# EasyEDA schematic SCH_L298N_shame_2022-05-20.json
TITLE: L298N; REV: 1.0; Date: 2022-05-20; Sheet: 1/1; Drawn By: Дмитрий Григорьев; Company: Your Company
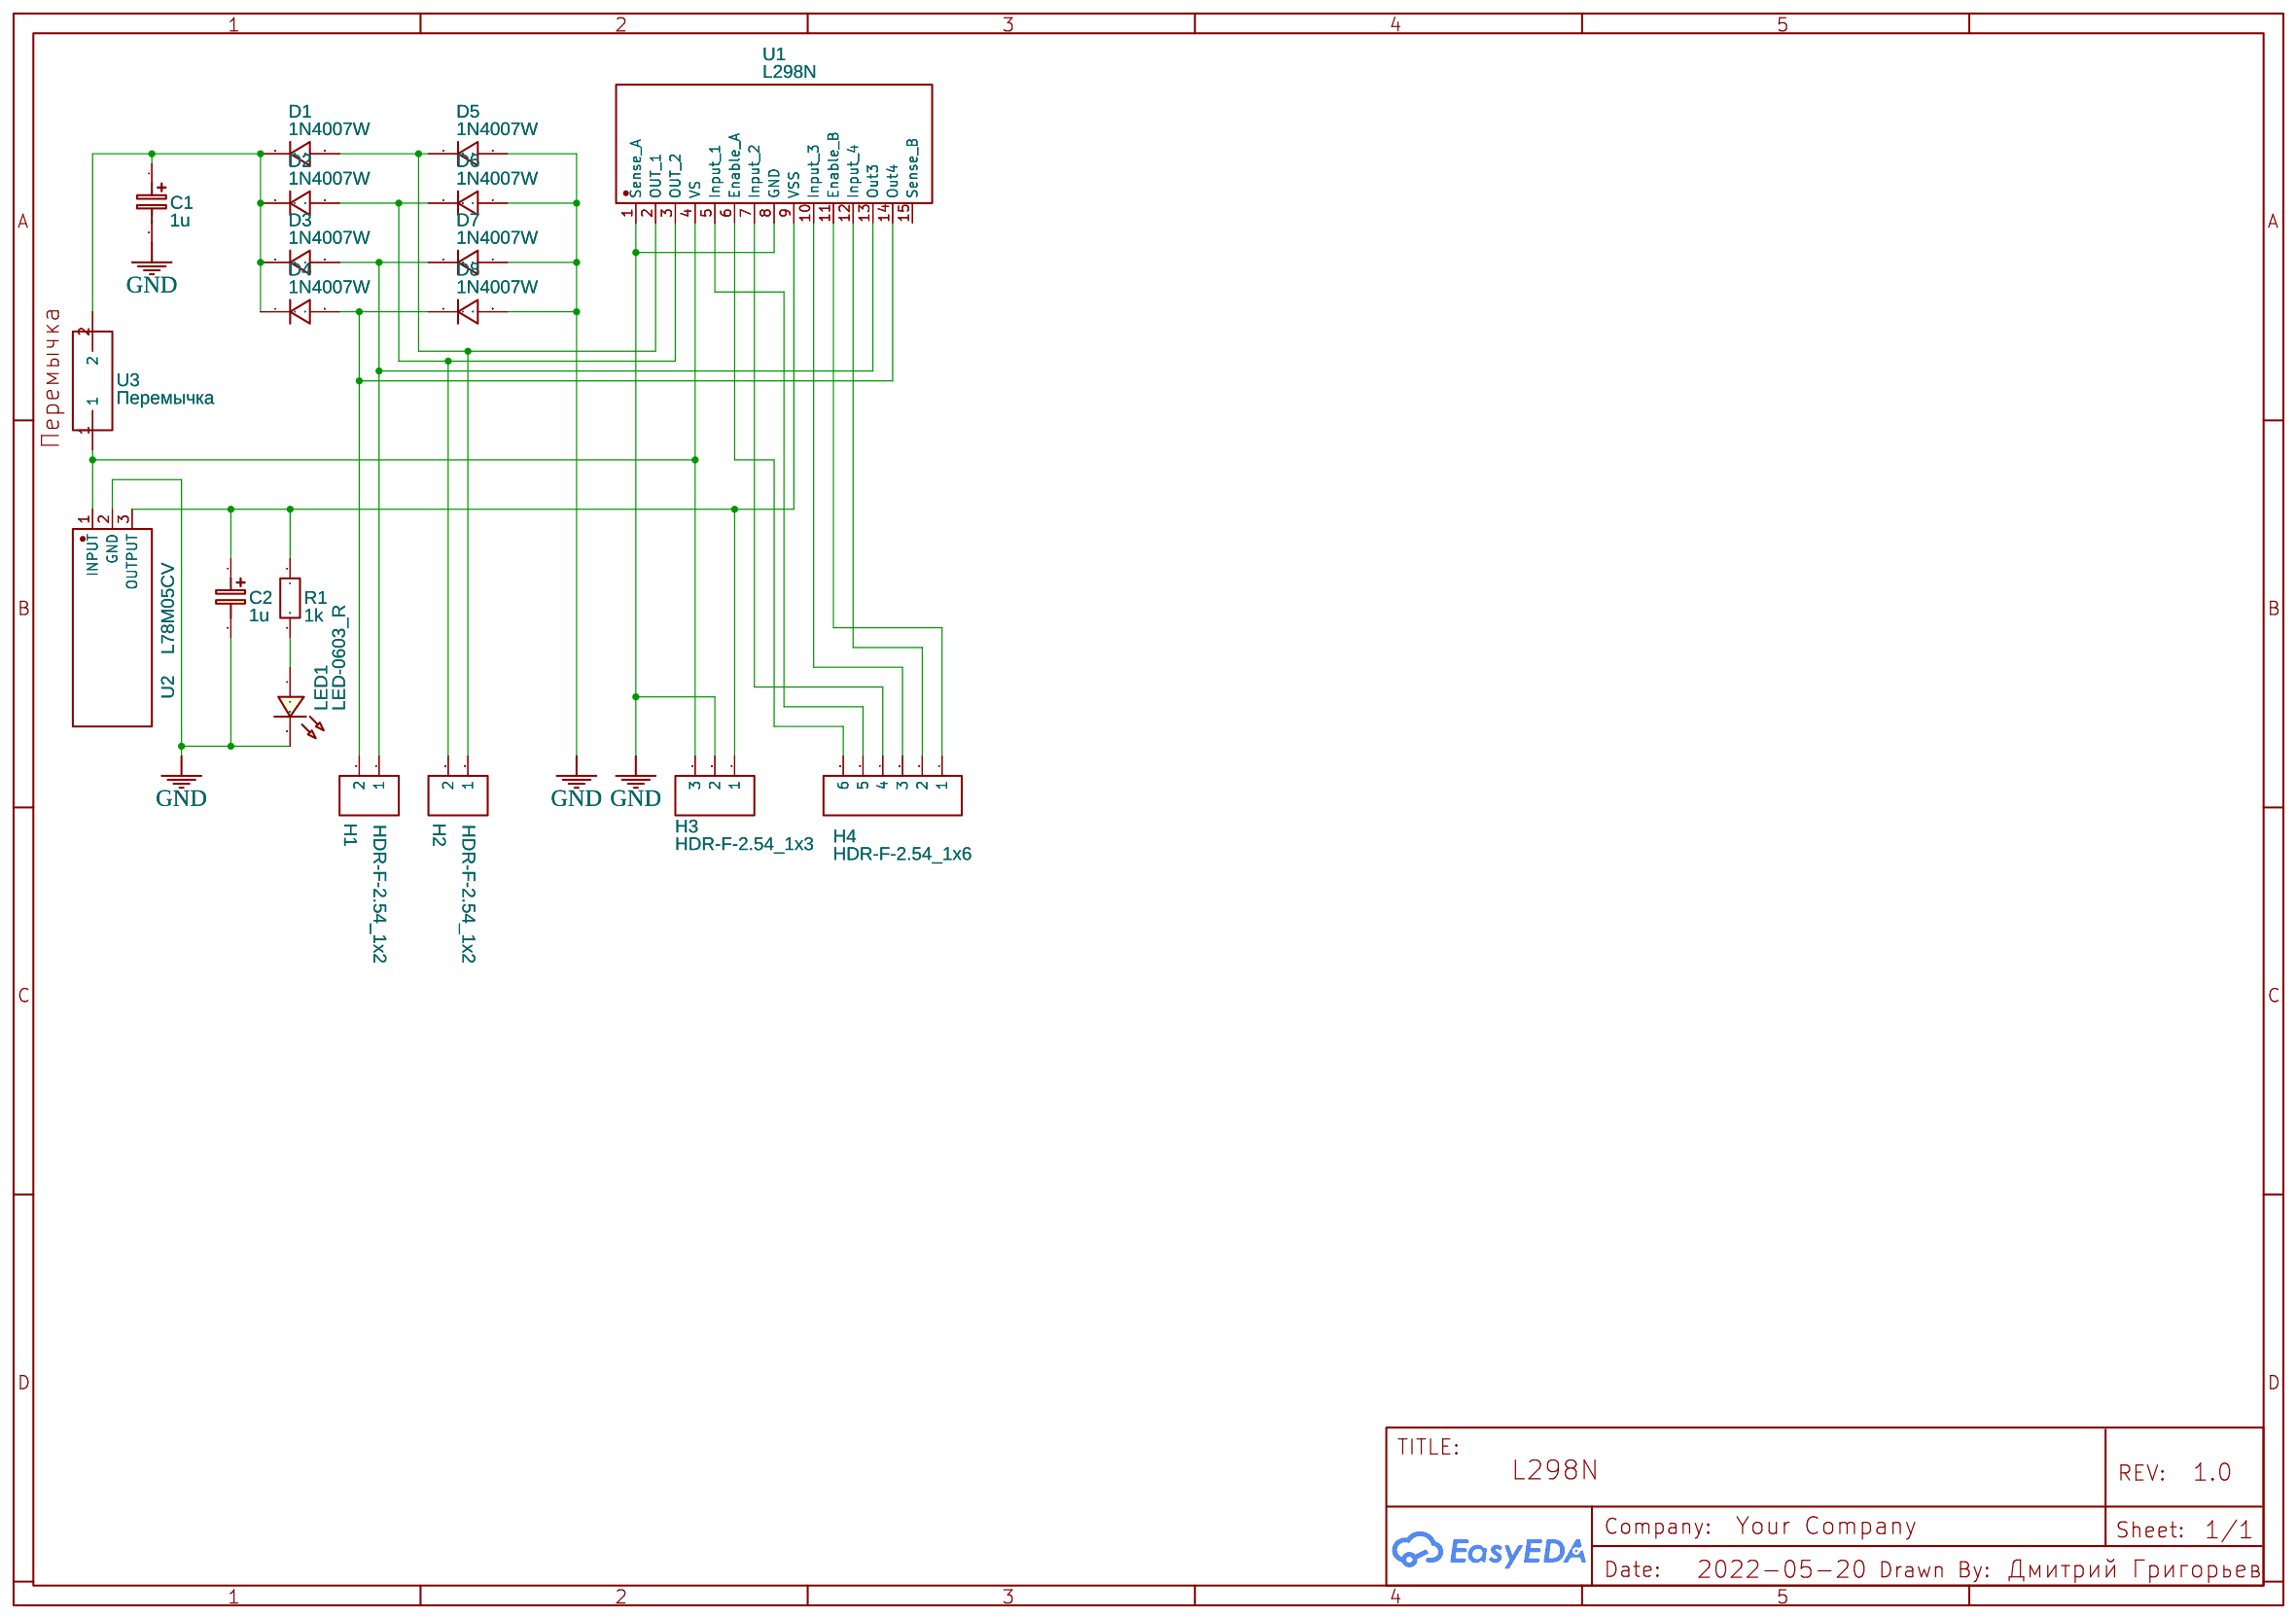
[diagram p0: schematic sheet]

## Parts
C1  1u  [CASE-A_3216]
C2  1u  [CASE-A_3216]
D1  1N4007W  [SOD-123_L2.8-W1.8-LS3.7-RD]
D2  1N4007W  [SOD-123_L2.8-W1.8-LS3.7-RD]
D3  1N4007W  [SOD-123_L2.8-W1.8-LS3.7-RD]
D4  1N4007W  [SOD-123_L2.8-W1.8-LS3.7-RD]
D5  1N4007W  [SOD-123_L2.8-W1.8-LS3.7-RD]
D6  1N4007W  [SOD-123_L2.8-W1.8-LS3.7-RD]
D7  1N4007W  [SOD-123_L2.8-W1.8-LS3.7-RD]
D8  1N4007W  [SOD-123_L2.8-W1.8-LS3.7-RD]
H1  HDR-F-2.54_1x2  [HDR-F-2.54_1X2]
H2  HDR-F-2.54_1x2  [HDR-F-2.54_1X2]
H3  HDR-F-2.54_1x3  [HDR-F-2.54_1X3]
H4  HDR-F-2.54_1x6  [HDR-F-2.54_1X6]
LED1  LED-0603_R  [LED0603_RED]
R1  1k  [R0603]
U1  L298N  [MULTIWATT-15_L19.6-W5.0-P1.27-L]
U2  L78M05CV  [TO-220-3_L10.0-W4.5-P2.54-L]
U3  Перемычка  [ПЕРЕМЫЧКА]

## Library data of the parts
C1 C2 = C_Tan_SMD_A_EU: Contributor: LCEDA_Lib
D1-D8 = 1N4007W: Supplier: LCSC; Supplier Part: C328592; Manufacturer: BLUE ROCKET; Contributor: LCEDA_Lib
H1 H2 = HDR-F-2.54_1x2: Supplier Part: C49661; Supplier: LCSC; Contributor: LCEDA_Lib
H3 = HDR-F-2.54_1x3: Supplier Part: C146690; Supplier: LCSC; Contributor: LCEDA_Lib
H4 = HDR-F-2.54_1x6: Supplier Part: C40877; Supplier: LCSC; Contributor: LCEDA_Lib
LED1 = LED-0603_R: Manufacturer: EVERLIGHT(台湾亿光); Manufacturer Part: 19-217/R6C-AL1M2VY/3T; Supplier Part: C72044; Supplier: LCSC; Contributor: LCEDA_01
R1 = R_0603_EU: Contributor: LCEDA_Lib
U1 = L298N: Supplier: LCSC; Supplier Part: C434589; Manufacturer: HGSEMI; Contributor: LCSC; JLCPCB Part Class: Extended Part
U2 = L78M05CV: Supplier: LCSC; Supplier Part: C283462; Manufacturer: STMicroelectronics; Contributor: LCSC; JLCPCB Part Class: Extended Part
U3 = Перемычка: Manufacturer Part: New SchematicLib; Contributor: protoplaz

## Nets
GND: C1.2 C2.2 D5.2 D6.2 D7.2 D8.2 H3.2 LED1.2 U1.1(Sense A) U1.8(GND) U2.2(GND)
Net-(C1-1): C1.1 D1.1 D2.1 D3.1 D4.1 U3.2
Net-(C2-1): C2.1 H3.1 R1.1 U1.9(VSS) U2.3(OUTPUT)
Net-(D1-2): D1.2 D5.1 H2.1 U1.2(OUT 1)
Net-(D2-2): D2.2 D6.1 H2.2 U1.3(OUT 2)
Net-(D3-2): D3.2 D7.1 H1.1 U1.13(Out3)
Net-(D4-2): D4.2 D8.1 H1.2 U1.14(Out4)
Net-(H3-3): H3.3 U1.4(VS) U2.1(INPUT) U3.1
Net-(H4-1): H4.1 U1.11(Enable B)
Net-(H4-2): H4.2 U1.12(Input 4)
Net-(H4-3): H4.3 U1.10(Input 3)
Net-(H4-4): H4.4 U1.7(Input 2)
Net-(H4-5): H4.5 U1.5(Input 1)
Net-(H4-6): H4.6 U1.6(Enable A)
Net-(LED1-1): LED1.1 R1.2

Not connected (* = marked no-connect by the designer): U1 15(Sense B)
